# EAGLE schematic page1 (EAGLE 6.5.0)
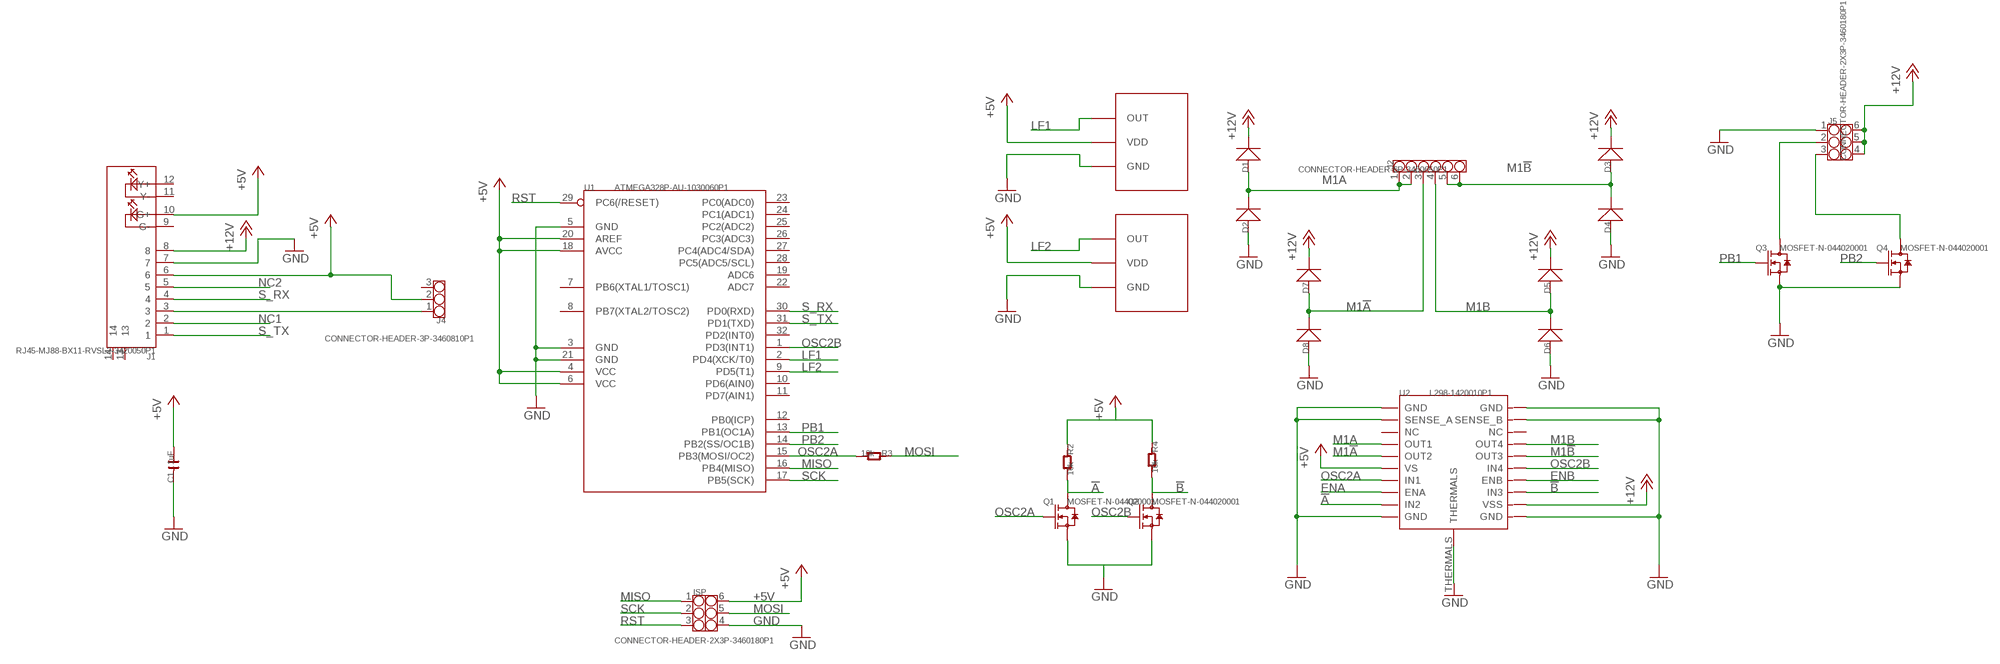
[diagram p0: schematic, sheet 1]

## Parts
C1  1uF  C-0805  [C0805]
D1  D-SMA  [DO-214AC]
D2  D-SMA  [DO-214AC]
D3  D-SMA  [DO-214AC]
D4  D-SMA  [DO-214AC]
D5  D-SMA  [DO-214AC]
D6  D-SMA  [DO-214AC]
D7  D-SMA  [DO-214AC]
D8  D-SMA  [DO-214AC]
ISP  CONNECTOR-HEADER-2X3P-3460180P1  [2X3P-2.54-2.54-11.6-3.0-BLACK-MALE]
J1  RJ45-MJ88-BX11-RVSL2-3420050P1  [RJ45-MJ88-BX11-RVSL2]
J2  CONNECTOR-HEADER-6P-3460650P1  [1X6P-2.54-2.54-11.6-3.0-BLACK-MALE]
J4  CONNECTOR-HEADER-3P-3460810P1  [1X3P-2.54-2.54-11.6-3.0-BLACK-MALE]
J5  CONNECTOR-HEADER-2X3P-3460180P1  [2X3P-2.54-2.54-11.6-3.0-BLACK-MALE]
Q1  MOSFET-N-044020001  [SOT23]
Q2  MOSFET-N-044020001  [SOT23]
Q3  MOSFET-N-044020001  [SOT23]
Q4  MOSFET-N-044020001  [SOT23]
R2  10k  R-0603  [R0603]
R3  10k  R-0603  [R0603]
R4  10k  R-0603  [R0603]
U1  ATMEGA328P-AU-1030060P1  [TQFP32]
U2  L298-1420010P1  [POWERSO-20]
U$5  TSL235  [TSL235R-2MM-S]
U$6  TSL235  [TSL235R-2MM-S]

## Nets
!A: Q1.3(D) R2.2 U2.9(IN2)
!B: Q2.3(D) R4.2 U2.13(IN3)
+5V [pwr12]: C1.2 ISP.6 J1.6 J1.10(G+) J4.2 R2.1 R4.1 U1.4(VCC) U1.6(VCC) U1.18(AVCC) U1.20(AREF) U2.6(VS) U$5.P$2(VDD) U$6.P$2(VDD)
+12V [pwr12]: D1.2(-) D3.2(-) D5.2(-) D7.2(-) J1.8 J5.4 J5.5 J5.6 U2.12(VSS)
ENA: U2.8(ENA)
ENB: U2.14(ENB)
GND: C1.1 D2.1(+) D4.1(+) D6.1(+) D8.1(+) ISP.4 J1.7 J5.1 Q1.2(S) Q2.2(S) Q3.2(S) Q4.2(S) U1.3(GND) U1.5(GND) U1.21(GND) U2.1(GND) U2.2(SENSE_A) U2.10(GND) U2.11(GND) U2.19(SENSE_B) U2.20(GND) U2.THERMALS U$5.P$1(GND) U$6.P$1(GND)
LF1: U1.2(PD4(XCK/T0)) U$5.P$3(OUT)
LF2: U1.9(PD5(T1)) U$6.P$3(OUT)
M1!A: D7.1(+) D8.2(-) J2.3 U2.5(OUT2)
M1!B: D3.1(+) D4.2(-) J2.5 J2.6 U2.16(OUT3)
M1A: D1.1(+) D2.2(-) J2.1 J2.2 U2.4(OUT1)
M1B: D5.1(+) D6.2(-) J2.4 U2.17(OUT4)
MISO: ISP.1 U1.16(PB4(MISO))
MOSI: ISP.5 R3.1
N$1: J1.3 J4.1
N$3: J5.3 Q4.3(D)
N$4: J5.2 Q3.3(D)
NC1: J1.2
NC2: J1.5
OSC2A: Q1.1(G) R3.2 U1.15(PB3(MOSI/OC2)) U2.7(IN1)
OSC2B: Q2.1(G) U1.1(PD3(INT1)) U2.15(IN4)
PB1: Q3.1(G) U1.13(PB1(OC1A))
PB2: Q4.1(G) U1.14(PB2(SS/OC1B))
RST: ISP.3 U1.29(PC6(/RESET))
S_RX: J1.4 U1.30(PD0(RXD))
S_TX: J1.1 U1.31(PD1(TXD))
SCK: ISP.2 U1.17(PB5(SCK))
Unconnected: J1.9(G-) J1.11(Y-) J1.12(Y+) J1.13 J1.14 J4.3 U1.7(PB6(XTAL1/TOSC1)) U1.8(PB7(XTAL2/TOSC2)) U1.10(PD6(AIN0)) U1.11(PD7(AIN1)) U1.12(PB0(ICP)) U1.19(ADC6) U1.22(ADC7) U1.23(PC0(ADC0)) U1.24(PC1(ADC1)) U1.25(PC2(ADC2)) U1.26(PC3(ADC3)) U1.27(PC4(ADC4/SDA)) U1.28(PC5(ADC5/SCL)) U1.32(PD2(INT0)) U2.3(NC) U2.18(NC)

## Library data of the parts
C1 = OPL Eagle Library:C*
D1-D8 = OPL Eagle Library:D*: DIODE
ISP J5 = OPL Eagle Library:CONNECTOR-HEADER-2X3P
J1 = OPL Eagle Library:RJ45-MJ88-BX11-RVSL2: Modular Jack 8P8C,R/A,With LED When you use the footprint ,place notice 46 (layer)milling ,there is some important information.
J2 = OPL Eagle Library:CONNECTOR-HEADER-6P
J4 = OPL Eagle Library:CONNECTOR-HEADER-3P
Q1-Q4 = OPL Eagle Library:MOSFET-N: CJ2302：SMD MOSFET N-CH 20V-2.1A
R2-R4 = OPL Eagle Library:R*
U1 = OPL Eagle Library:ATMEGA328P-AU: 8-bit AVR Microcontroller with 32K Bytes In-System Programmable Flash
U2 = OPL Eagle Library:L298: Dual Full-Bridge Driver http://www.sandorobotics.com/attachments/l298motores.pdf
U$5 U$6 = Chris_parts:TSL235

## Net classes
0 default: width 0.254 mm, clearance 0.254 mm
1 pwr12: width 0.305 mm, drill 0.61 mm, clearance 0.254 mm